# EAGLE design Rotary Encoder (EAGLE 9.3.2)
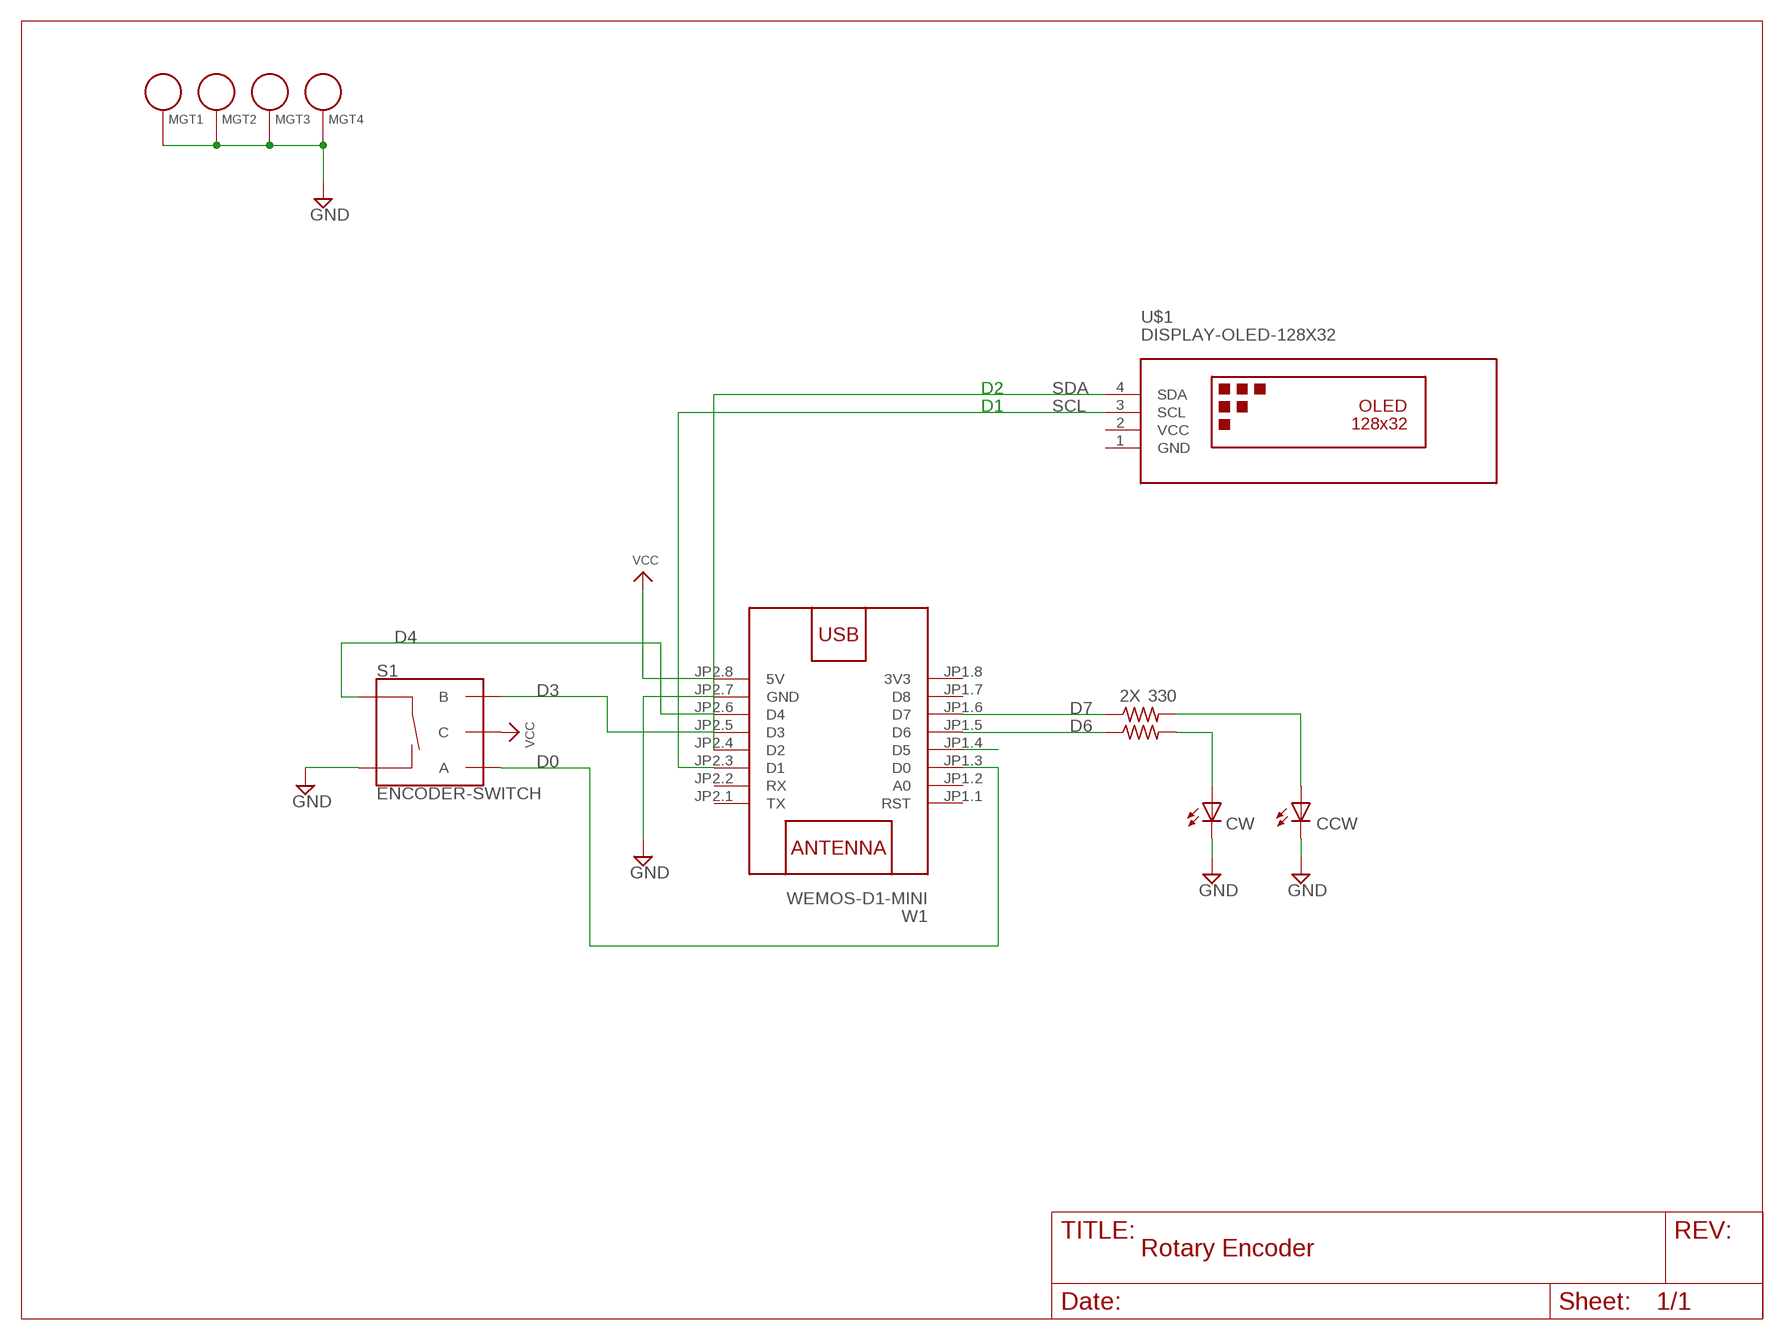
[diagram p0: schematic, sheet 1]

## Parts
2X  R-US_0207/10  [0207/10]
330  R-US_0207/10  [0207/10]
CCW  LED5MM  [LED5MM]
CW  LED5MM  [LED5MM]
MGT1  BEAGLEBONEBLACK_MOUNTING_HOLE  [BEAGLEBONEBLACK_MOUNTING_HOLE]
MGT2  BEAGLEBONEBLACK_MOUNTING_HOLE  [BEAGLEBONEBLACK_MOUNTING_HOLE]
MGT3  BEAGLEBONEBLACK_MOUNTING_HOLE  [BEAGLEBONEBLACK_MOUNTING_HOLE]
MGT4  BEAGLEBONEBLACK_MOUNTING_HOLE  [BEAGLEBONEBLACK_MOUNTING_HOLE]
S1  ENCODER-SWITCH  [ROTARY_ENC_PLAIN]
U$1  DISPLAY-OLED-128X32  [DISPLAY-OLED-128X32]
W1  WEMOS-D1-MINI  [WEMOS-D1-MINI]

## Nets
D0: S1.A W1.JP1.3(D0)
D1: U$1.3(SCL) W1.JP2.3(D1)
D3: S1.B W1.JP2.5(D3)
D4: S1.SW+ W1.JP2.6(D4)
D6: 2X.1 W1.JP1.5(D6)
D7: 330.1 W1.JP1.6(D7)
GND: CCW.K(C) CW.K(C) MGT1.P$1 MGT2.P$1 MGT3.P$1 MGT4.P$1 S1.SW- W1.JP2.7(GND)
N$3: 330.2 CCW.A
N$4: 2X.2 CW.A
SCL: W1.JP1.4(D5)
SDA: U$1.4(SDA) W1.JP2.4(D2)
VCC: S1.C W1.JP2.8(5V)
Unconnected: W1.JP1.1(RST) W1.JP1.2(A0) W1.JP1.7(D8) W1.JP2.1(TX) W1.JP2.2(RX)

## Notes on the sheet
- D2
- D1

## Power pins joined to a net without a drawn wire
3V3: W1.JP1.8(3V3)
GND: U$1.1(GND)
VCC: U$1.2(VCC)

## Library data of the parts
2X 330 = adafruit:R-US_: RESISTOR, American symbol
CCW CW = adafruit:LED: LED OSRAM: - CHIPLED LG R971, LG N971, LY N971, LG Q971, LY Q971, LO R971, LY R971 LH N974, LH R974 LS Q976, LO Q976, LY Q976 LO Q996 - Hyper CHIPLED LW Q18S LB Q993, LB Q99A, LB R99A - SideLED LS A670, LO A670, LY A670, LG A670, LP A670 LB A673, LV A673, LT A673, LW A673 LH A674 LY A675 LS A676, LA A676, LO A676, LY A676, LW A676 LS A679, LY A679, LG A679 - Hyper Micro SIDELED® LS Y876, LA Y876, LO Y876, LY Y876 LT Y87S - SmartLED LW L88C, LW L88S LB L89C, LB L89S, LG L890 LS L89K, LO L89K, LY L89K LS L896, LA L896, LO L896, LY L896 - TOPLED LS T670, LO T670, LY T670, LG T670, LP T670 LSG T670, LSP T670, LSY T670, LOP T670, LYG T670 LG T671, LOG T671, LSG T671 LB T673, LV T673, LT T673, LW T673 LH T674 LS T676, LA T676, LO T676, LY T676, LB T676, LH T676, LSB T676, LW T676 LB T67C, LV T67C, LT T67C, LS T67K, LO T67K, LY T67K, LW E67C LS E67B, LA E67B, LO E67B, LY E67B, LB E67C, LV E67C, LT E67C LW T67C LS T679, LY T679, LG T679 LS T770, LO T770, LY T770, LG T770, LP T770 LB T773, LV T773, LT T773, LW T773 LH T774 LS E675, LA E675, LY E675, LS T675 LS T776, LA T776, LO T776, LY T776, LB T776 LHGB T686 LT T68C, LB T68C - Hyper Mini TOPLED® LB M676 - Mini TOPLED Santana® LG M470 LS M47K, LO M47K, LY M47K Source: http://www.osram.convergy.de/
MGT1-MGT4 = BeagleBone_Black_Wireless:BEAGLEBONEBLACK_MOUNTING_HOLE: Chassis Mounting Hole w/GND connection ability
S1 = SparkFun-Switches:ENCODER-SWITCH: Rotary Encoder w/ Select Switch Encoders rotate similarly to potentiometers, but they’re different from potentiometers in that an encoder has full rotation without limits. They output gray code so that you can tell how much and in which direction the encoder has been turned. This encoder includes a push-down select switch built into the shaft. SparkFun Products Rotary Encoder <https://www.sparkfun.com/products/9117> (COM-09117); SF_SKU: COM-09117
U$1 = diy-modules:DISPLAY-OLED-128X32: 128x32 Dot Matrix OLED Module with I2C interface based on SSD1306 chip More details available here: http://www.tinyosshop.com/index.php?route=product/product&product_id=953 Schematic available here: http://www.tinyosshop.com/datasheet/OLED%2012832.pdf SSD1306 datasheet: https://cdn-shop.adafruit.com/datasheets/SSD1306.pdf Click here to find device on ebay.com <http://www.ebay.com/sch/oled+display+128x32+i2c>
W1 = diy-modules:WEMOS-D1-MINI: WEMOS D1 mini: Mini Wi-Fi Board based on ESP-8266 device More details can be found here: https://www.wemos.cc/product/d1-mini.html Click here to find device on ebay.com <http://www.ebay.com/sch/wemos+d1+mini+nodemcu>

## Board
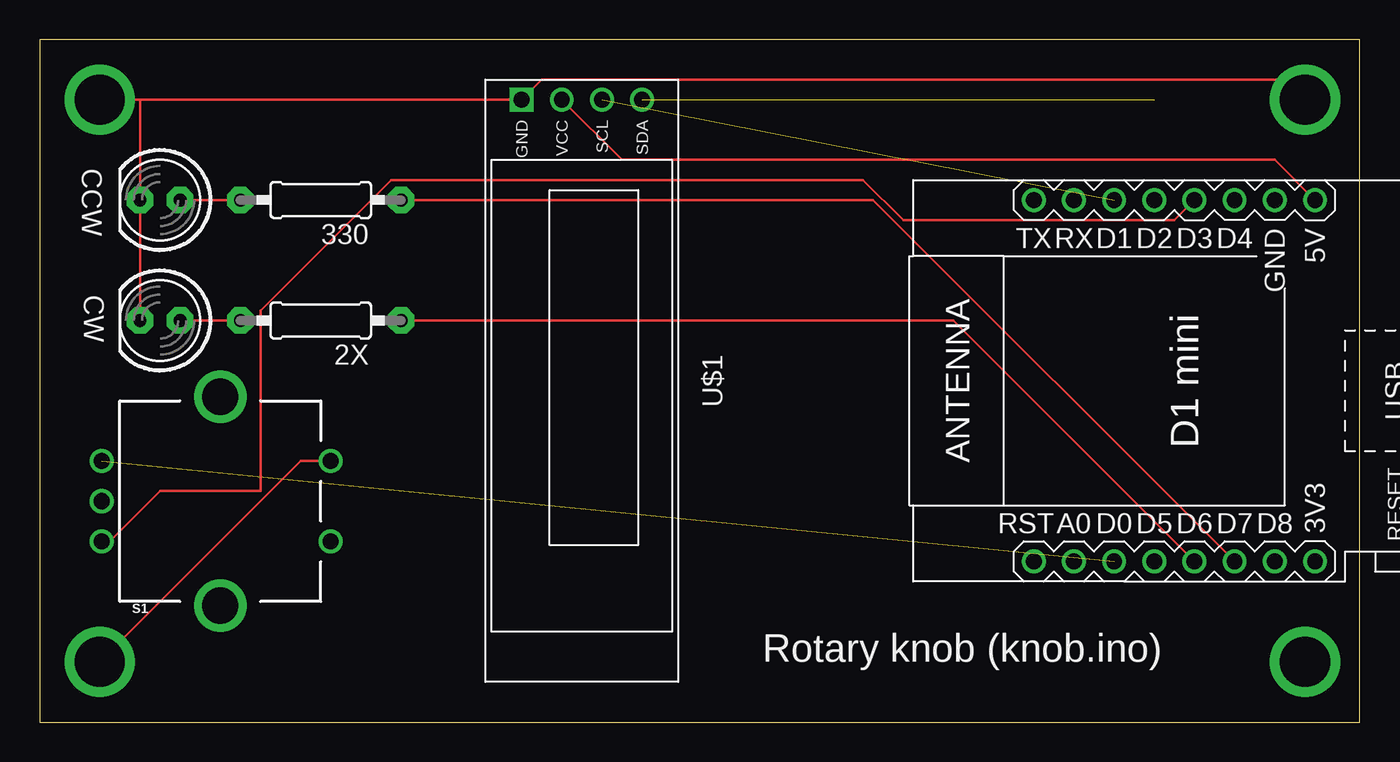
[diagram p1: board, top side]
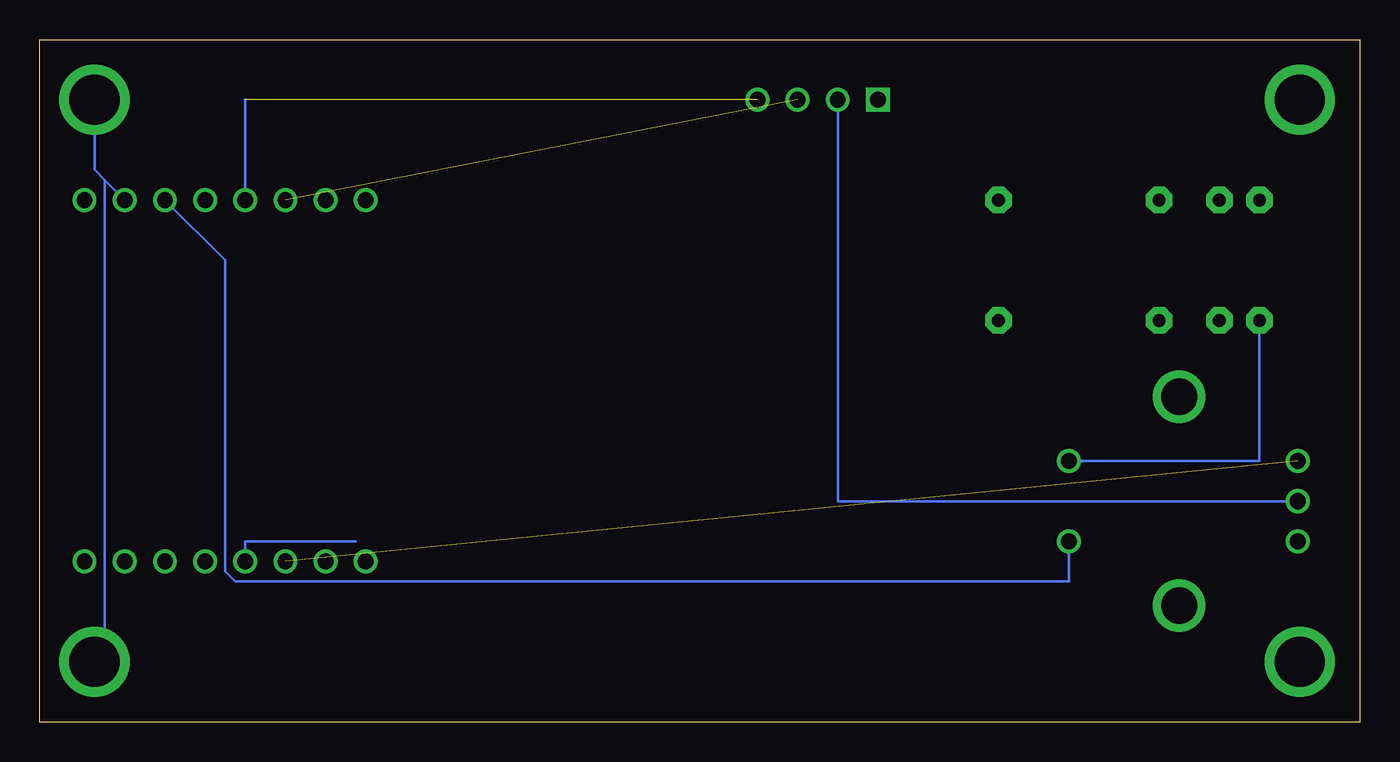
[diagram p2: board, bottom side, seen from below]

Size 83.49 x 43.17 mm. Coordinates in mm from the lower left corner, seen from the top.
Outline: 0,0 83.49,0 83.49,43.17 0,43.17 0,0
Copper layers (1*16): Top 0.035mm / dielectric 1.5mm / Bottom 0.035mm
Design rules "default": minimum track width 6mil, minimum drill 0.35mm, track to track 6mil, track to pad 6mil, pad to pad 6mil, via to via 6mil, smd to smd 6mil, copper to edge 40mil, drill to drill 6mil, minimum pad ring 10mil, minimum via ring 8mil, stop-mask expansion 4mil, vias tented up to drill 0mil, thermal gap 10mil

### Footprints (pad centres in the part's own frame; a part is rotated, then mirrored left to right if it is on the bottom)
0207/10 = drill 0.813 pad 1.676 octagon: 1 -5.08,0; 2 5.08,0
LED5MM = drill 0.813 pad 1.676 octagon: A -1.27,0; K 1.27,0
BEAGLEBONEBLACK_MOUNTING_HOLE = drill 3.175 pad 4.445: P$1 0,0
ROTARY_ENC_PLAIN = drill 1.016: A 7.493,-2.54; B 7.493,2.54; C 7.493,0; SW+ -6.985,2.54; SW- -6.985,-2.54 | drill 2.286: P$3 0,6.604; P$4 0,-6.604
DISPLAY-OLED-128X32 = drill 1 square: 1 -17.78,-3.81 | drill 1: 2 -17.78,-1.27; 3 -17.78,1.27; 4 -17.78,3.81
WEMOS-D1-MINI = drill 1: JP1.1 -11.43,9.525; JP1.2 -11.43,6.985; JP1.3 -11.43,4.445; JP1.4 -11.43,1.905; JP1.5 -11.43,-0.635; JP1.6 -11.43,-3.175; JP1.7 -11.43,-5.715; JP1.8 -11.43,-8.255; JP2.1 11.43,9.525; JP2.2 11.43,6.985; JP2.3 11.43,4.445; JP2.4 11.43,1.905; JP2.5 11.43,-0.635; JP2.6 11.43,-3.175; JP2.7 11.43,-5.715; JP2.8 11.43,-8.255

### Placement (x,y rotation side)
2X  17.78,25.4 180 top
330  17.78,33.02 180 top
CCW  7.62,33.02 180 top
CW  7.62,25.4 180 top
MGT1  3.81,39.37 0 top
MGT2  80.01,39.37 0 top
MGT3  80.01,3.81 0 top
MGT4  3.81,3.81 0 top
S1  11.43,13.97 180 top
U$1  34.29,21.59 270 top
W1  72.39,21.59 90 top

### Tracks (layer width: path | path; a pad name or v marks a point on that pad's centre or on a via)
D0  (1 unrouted)
D1  (1 unrouted)
D3
  Top 0.152: W1.JP2.5 71.75,31.75 54.61,31.75 52.07,34.29 22.23,34.29 13.97,26.04 13.97,14.61 7.62,14.61 4.45,11.43 S1.B
D4
  Bottom 0.152: W1.JP2.6 71.75,29.21 71.75,9.53 71.12,8.89 18.41,8.89 S1.SW+
D6
  Top 0.152: W1.JP1.5 57.78,25.4 2X.1
D7
  Top 0.152: W1.JP1.6 52.7,33.02 330.1
GND
  Top 0.152: MGT1.P$1 6.35,39.37 | 6.35,39.37 U$1.1 31.75,40.64 78.74,40.64 MGT2.P$1 | 6.35,39.37 CCW.K CW.K | MGT4.P$1 16.51,16.51 S1.SW-
  Bottom 0.152: 79.38,34.29 80.01,34.92 MGT2.P$1 | 79.38,34.29 W1.JP2.7 | MGT3.P$1 79.38,4.45 79.38,34.29 | S1.SW- 6.35,16.51 CW.K
N$3
  Top 0.152: 330.2 CCW.A
N$4
  Top 0.152: 2X.2 CW.A
SCL
  Bottom 0.152: 63.5,11.43 70.48,11.43 W1.JP1.4
SDA  (1 unrouted)
  Bottom 0.152: W1.JP2.4 70.48,39.37
VCC
  Top 0.152: U$1.2 36.83,35.56 78.11,35.56 W1.JP2.8
  Bottom 0.152: S1.C 33.02,13.97 U$1.2

### Text on the board
tPlace: Rotary knob (knob.ino)